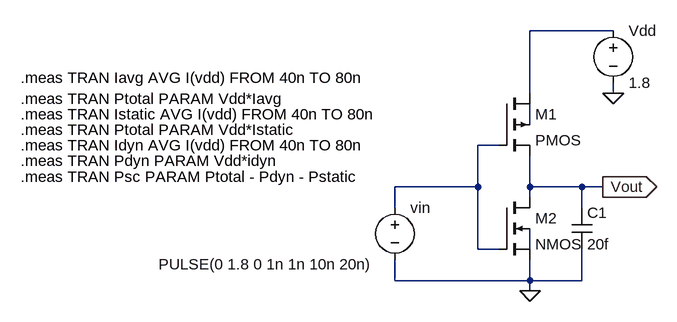
[diagram p0: schematic post2.asc]
post2.asc, the LTspice schematic file:
Version 4.1
SHEET 1 880 680
WIRE 336 -96 208 -96
WIRE 208 0 208 -96
WIRE 336 0 336 -16
WIRE 208 48 208 16
WIRE 160 80 128 80
WIRE 128 144 128 80
WIRE 128 144 0 144
WIRE 208 144 208 96
WIRE 288 144 208 144
WIRE 320 144 288 144
WIRE 208 160 208 144
WIRE 0 176 0 144
WIRE 288 176 288 144
WIRE 128 240 128 144
WIRE 160 240 128 240
WIRE 208 240 208 208
WIRE 0 288 0 256
WIRE 208 288 208 256
WIRE 208 288 0 288
WIRE 288 288 288 240
WIRE 288 288 208 288
WIRE 208 304 208 288
FLAG 208 304 0
FLAG 336 0 0
FLAG 320 144 Vout
IOPIN 320 144 Out
SYMBOL pmos4 160 0 R0
SYMATTR InstName M1
SYMBOL nmos4 160 160 R0
SYMATTR InstName M2
SYMBOL voltage 336 -112 R0
WINDOW 123 0 0 Left 0
WINDOW 39 0 0 Left 0
SYMATTR InstName Vdd
SYMATTR Value 1.8
SYMBOL voltage 0 160 R0
WINDOW 3 -364 103 Left 2
WINDOW 123 0 0 Left 0
WINDOW 39 0 0 Left 0
SYMATTR InstName vin
SYMATTR Value PULSE(0 1.8 0 1n 1n 10n 20n)
SYMBOL cap 272 176 R0
SYMATTR InstName C1
SYMATTR Value 20f
TEXT -576 -24 Left 2 !.meas TRAN Iavg AVG I(vdd) FROM 40n TO 80n
TEXT -576 8 Left 2 !.meas TRAN Ptotal PARAM Vdd*Iavg
TEXT -576 32 Left 2 !.meas TRAN Istatic AVG I(vdd) FROM 40n TO 80n
TEXT -576 56 Left 2 !.meas TRAN Ptotal PARAM Vdd*Istatic
TEXT -576 80 Left 2 !.meas TRAN Idyn AVG I(vdd) FROM 40n TO 80n
TEXT -576 104 Left 2 !.meas TRAN Pdyn PARAM Vdd*idyn
TEXT -576 128 Left 2 !.meas TRAN Psc PARAM Ptotal - Pdyn - Pstatic

The netlist it stands for:
* post2.asc
M1 N001 N003 Vout N002 PMOS
M2 Vout N003 0 N004 NMOS
Vdd N001 0 1.8
vin N003 0 PULSE(0 1.8 0 1n 1n 10n 20n)
C1 Vout 0 20f
.model NMOS NMOS
.model PMOS PMOS
.lib standard.mos
.meas TRAN Iavg AVG I(vdd) FROM 40n TO 80n
.meas TRAN Ptotal PARAM Vdd*Iavg
.meas TRAN Istatic AVG I(vdd) FROM 40n TO 80n
.meas TRAN Ptotal PARAM Vdd*Istatic
.meas TRAN Idyn AVG I(vdd) FROM 40n TO 80n
.meas TRAN Pdyn PARAM Vdd*idyn
.meas TRAN Psc PARAM Ptotal - Pdyn - Pstatic
.backanno
.end